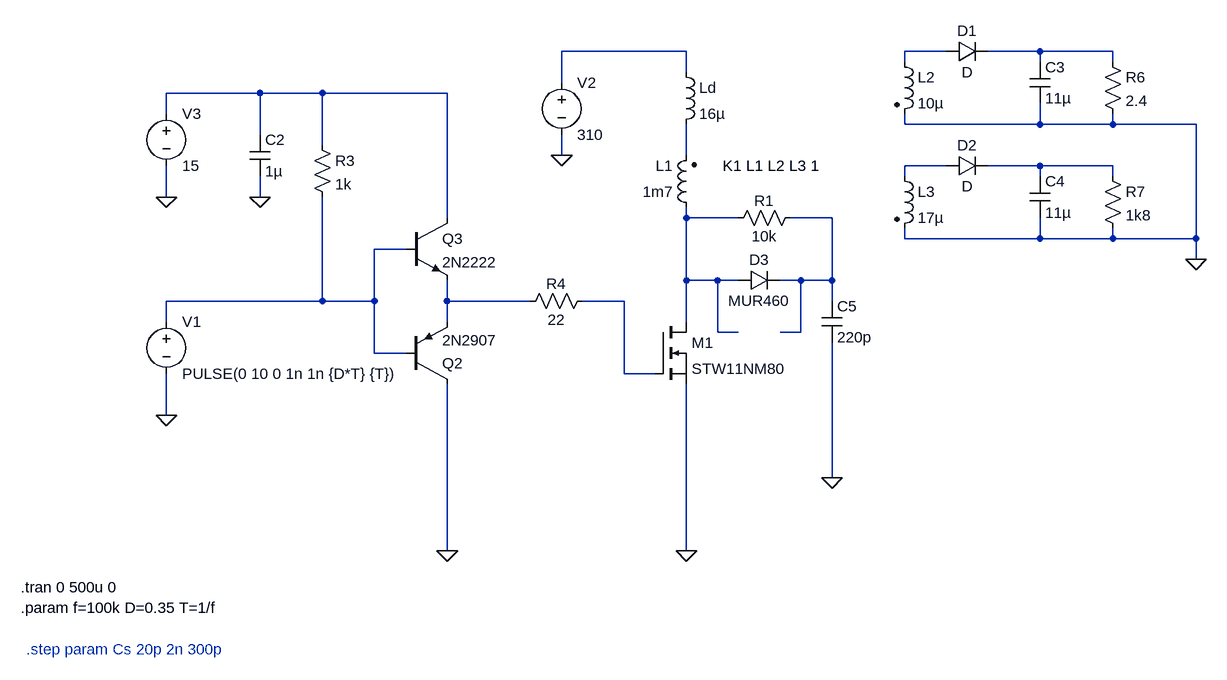
[diagram p0: schematic Flyback.asc]
Flyback.asc, the LTspice schematic file:
Version 4
SHEET 1 1308 680
WIRE 304 -320 112 -320
WIRE 704 -320 640 -320
WIRE 848 -320 768 -320
WIRE 960 -320 848 -320
WIRE 640 -304 640 -320
WIRE 848 -304 848 -320
WIRE 960 -304 960 -320
WIRE 304 -288 304 -320
WIRE 112 -272 112 -320
WIRE -352 -256 -496 -256
WIRE -256 -256 -352 -256
WIRE -64 -256 -256 -256
WIRE -496 -224 -496 -256
WIRE 640 -208 640 -224
WIRE 848 -208 848 -240
WIRE 848 -208 640 -208
WIRE 960 -208 960 -224
WIRE 960 -208 848 -208
WIRE 1088 -208 960 -208
WIRE -352 -192 -352 -256
WIRE -256 -176 -256 -256
WIRE 112 -160 112 -192
WIRE 304 -160 304 -208
WIRE 704 -144 640 -144
WIRE 848 -144 768 -144
WIRE 960 -144 848 -144
WIRE 640 -128 640 -144
WIRE 848 -128 848 -144
WIRE 960 -128 960 -144
WIRE -496 -96 -496 -144
WIRE -352 -96 -352 -128
WIRE -64 -64 -64 -256
WIRE 304 -64 304 -80
WIRE 384 -64 304 -64
WIRE 528 -64 464 -64
WIRE 640 -32 640 -48
WIRE 848 -32 848 -64
WIRE 848 -32 640 -32
WIRE 960 -32 960 -48
WIRE 960 -32 848 -32
WIRE 1088 -32 1088 -208
WIRE 1088 -32 960 -32
WIRE -128 -16 -176 -16
WIRE 1088 0 1088 -32
WIRE 304 32 304 -64
WIRE 352 32 304 32
WIRE 384 32 352 32
WIRE 480 32 448 32
WIRE 528 32 528 -64
WIRE 528 32 480 32
WIRE -256 64 -256 -96
WIRE -256 64 -496 64
WIRE -176 64 -176 -16
WIRE -176 64 -256 64
WIRE -64 64 -64 32
WIRE 64 64 -64 64
WIRE 208 64 144 64
WIRE 528 64 528 32
WIRE -496 96 -496 64
WIRE -64 96 -64 64
WIRE 304 96 304 32
WIRE 352 112 352 32
WIRE 384 112 352 112
WIRE 480 112 480 32
WIRE 480 112 448 112
WIRE -176 144 -176 64
WIRE -128 144 -176 144
WIRE 208 176 208 64
WIRE 256 176 208 176
WIRE -496 240 -496 176
WIRE 528 336 528 128
WIRE -64 448 -64 192
WIRE 304 448 304 192
FLAG -352 -96 0
FLAG 112 -160 0
FLAG -496 -96 0
FLAG -496 240 0
FLAG -64 448 0
FLAG 304 448 0
FLAG 528 336 0
FLAG 1088 0 0
SYMBOL pnp -128 192 M180
SYMATTR InstName Q2
SYMATTR Value 2N2907
SYMBOL npn -128 -64 R0
SYMATTR InstName Q3
SYMATTR Value 2N2222
SYMBOL voltage -496 80 R0
WINDOW 123 0 0 Left 0
WINDOW 39 0 0 Left 0
SYMATTR InstName V1
SYMATTR Value PULSE(0 10 0 1n 1n {D*T} {T})
SYMBOL res -272 -192 R0
SYMATTR InstName R3
SYMATTR Value 1k
SYMBOL cap -368 -192 R0
SYMATTR InstName C2
SYMATTR Value 1µ
SYMBOL res 48 80 R270
WINDOW 0 27 56 VTop 2
WINDOW 3 3 56 VBottom 2
SYMATTR InstName R4
SYMATTR Value 22
SYMBOL nmos 256 96 R0
SYMATTR InstName M1
SYMATTR Value STW11NM80
SYMBOL voltage 112 -288 R0
WINDOW 123 0 0 Left 0
WINDOW 39 0 0 Left 0
SYMATTR InstName V2
SYMATTR Value 310
SYMBOL voltage -496 -240 R0
WINDOW 123 0 0 Left 0
WINDOW 39 0 0 Left 0
SYMATTR InstName V3
SYMATTR Value 15
SYMBOL cap 832 -304 R0
SYMATTR InstName C3
SYMATTR Value 11µ
SYMBOL res 944 -320 R0
SYMATTR InstName R6
SYMATTR Value 2.4
SYMBOL ind2 320 -64 R180
WINDOW 3 36 40 Left 2
WINDOW 0 36 80 Left 2
SYMATTR Value 1m7
SYMATTR InstName L1
SYMATTR Type ind
SYMBOL ind2 624 -320 R0
SYMATTR Value 10µ
SYMATTR InstName L2
SYMATTR Type ind
SYMBOL cap 832 -128 R0
SYMATTR InstName C4
SYMATTR Value 11µ
SYMBOL res 944 -144 R0
SYMATTR InstName R7
SYMATTR Value 1k8
SYMBOL ind2 624 -144 R0
SYMATTR Value 17µ
SYMATTR InstName L3
SYMATTR Type ind
SYMBOL cap 512 64 R0
SYMATTR InstName C5
SYMATTR Value 220p
SYMBOL res 368 -48 R270
WINDOW 0 27 56 VTop 2
WINDOW 3 3 56 VBottom 2
SYMATTR InstName R1
SYMATTR Value 10k
SYMBOL ind 288 -304 R0
SYMATTR Value 16µ
SYMATTR InstName Ld
SYMBOL diode 704 -304 R270
WINDOW 0 32 32 VTop 2
WINDOW 3 0 32 VBottom 2
SYMATTR InstName D1
SYMBOL diode 704 -128 R270
WINDOW 0 32 32 VTop 2
WINDOW 3 0 32 VBottom 2
SYMATTR InstName D2
SYMBOL diode 384 48 R270
WINDOW 0 32 32 VTop 2
WINDOW 3 0 32 VBottom 2
SYMATTR InstName D3
SYMATTR Value MUR460
TEXT -720 536 Left 2 !.param f=100k D=0.35 T=1/f
TEXT -720 504 Left 2 !.tran 0 500u 0
TEXT 360 -144 Left 2 !K1 L1 L2 L3 1
TEXT -712 600 Left 2 ;.step param Cs 20p 2n 300p

The netlist it stands for:
* Flyback.asc
Q2 0 N010 N011 0 2N2907
Q3 N004 N010 N011 0 2N2222
V1 N010 0 PULSE(0 10 0 1n 1n {D*T} {T})
R3 N004 N010 1k
C2 N004 0 1µ
R4 N011 N012 22
M1 N008 N012 0 0 STW11NM80
V2 N001 0 310
V3 N004 0 15
C3 N003 0 11µ
R6 N003 0 2.4
L1 N008 N005 1m7
L2 N002 0 10µ
C4 N007 0 11µ
R7 N007 0 1k8
L3 N006 0 17µ
C5 N009 0 220p
R1 N008 N009 10k
Ld N001 N005 16µ
D1 N002 N003 D
D2 N006 N007 D
D3 N008 N009 MUR460
.model D D
.lib standard.dio
.model NPN NPN
.model PNP PNP
.lib standard.bjt
.model NMOS NMOS
.model PMOS PMOS
.lib standard.mos
.param f=100k D=0.35 T=1/f
.tran 0 500u 0
K1 L1 L2 L3 1
* .step param Cs 20p 2n 300p
.backanno
.end